# Altium schematic sheet MCU.SchDoc
size A4
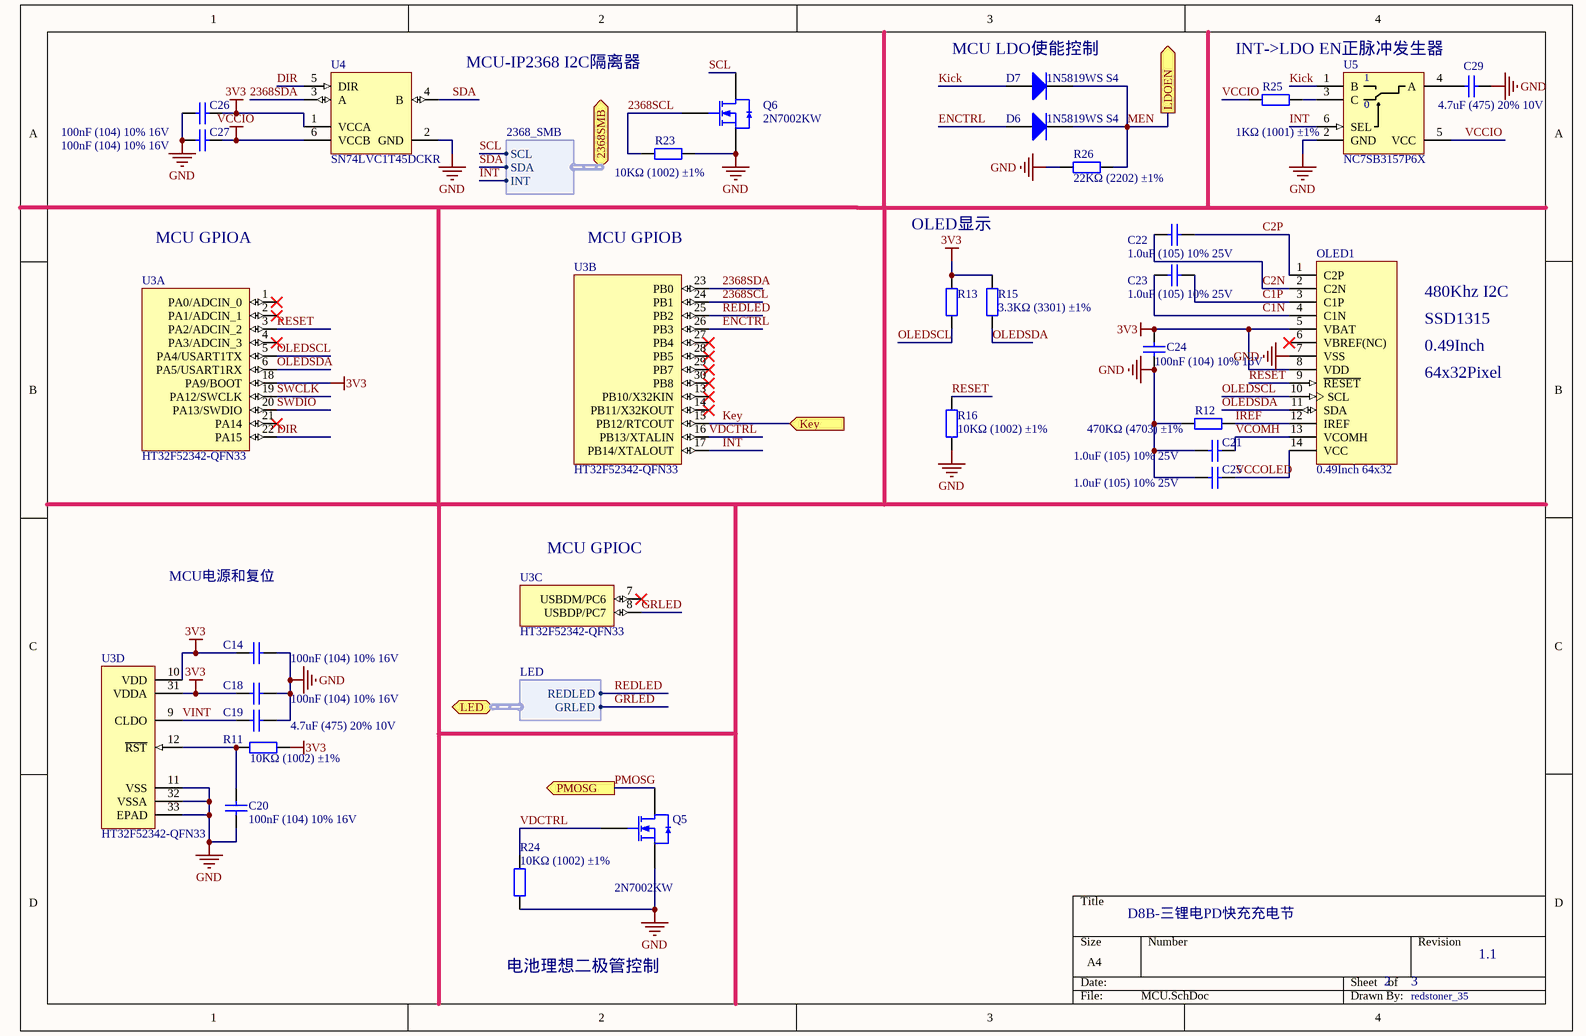
[diagram p0: MCU.SchDoc]

## Parts
C14  100nF (104) 10% 16V  [0402_C]
C18  100nF (104) 10% 16V  [0402_C]
C19  4.7uF (475) 20% 10V  [0402_C]
C20  100nF (104) 10% 16V  [0402_C]
C21  1.0uF (105) 10% 25V  [0402_C]
C22  1.0uF (105) 10% 25V  [0402_C]
C23  1.0uF (105) 10% 25V  [0402_C]
C24  100nF (104) 10% 16V  [0402_C]
C25  1.0uF (105) 10% 25V  [0402_C]
C26  100nF (104) 10% 16V  [0402_C]
C27  100nF (104) 10% 16V  [0402_C]
C29  4.7uF (475) 20% 10V  [0402_C]
D6  1N5819WS S4  [SOD-323]
D7  1N5819WS S4  [SOD-323]
OLED1  0.49Inch 64x32  [OLED-0.49Inch]
Q5  2N7002KW  [SC70-3]
Q6  2N7002KW  [SC70-3]
R11  10KΩ (1002) ±1%  [0402_R]
R12  470KΩ (4703) ±1%  [0402_R]
R13  3.3KΩ (3301) ±1%  [0402_R]  (value not drawn)
R15  3.3KΩ (3301) ±1%  [0402_R]
R16  10KΩ (1002) ±1%  [0402_R]
R23  10KΩ (1002) ±1%  [0402_R]
R24  10KΩ (1002) ±1%  [0402_R]
R25  1KΩ (1001) ±1%  [0402_R]
R26  22KΩ (2202) ±1%  [0402_R]
U3  HT32F52342-QFN33  [QFN32-HT32]  (parts A,B,C,D of 4)
U4  SN74LVC1T45DCKR  [DCK0006A_N]
U5  NC7SB3157P6X  [SC70-6]

## Ports
2368SMB (harness 2368_SMB), Key (in), LDOEN (out), LED (harness LED), PMOSG (out)

## Harnesses
2368_SMB: SCL, SDA, INT
LED: REDLED, GRLED

## Nets
3V3: C14.1 C18.1 C24.2 C26.2 OLED1.5(VBAT) OLED1.8(VDD) R11.2 R13.2 R15.2 U3.10(VDD) U3.18(PA9/BOOT) U3.31(VDDA) U4.1(VCCA)
GND: C14.2 C18.2 C19.2 C20.1 C21.2 C24.1 C25.1 C26.1 C27.1 C29.2 OLED1.7(VSS) Q5.2(S) Q6.2(S) R12.2 R16.1 R23.2 R24.1 R26.1 U3.11(VSS) U3.32(VSSA) U3.33(EPAD) U4.2(GND) U5.2(GND)
VCCIO: C27.2 R25.1 U4.6(VCCB) U5.5(VCC)
2368SCL: Q6.1(G) R23.1 U3.24(PB1)
2368SDA: U3.23(PB0) U4.3(A)
C1N: C23.2 OLED1.4(C1N)
C1P: C23.1 OLED1.3(C1P)
C2N: C22.2 OLED1.2(C2N)
C2P: C22.1 OLED1.1(C2P)
DIR: U3.22(PA15) U4.5(DIR)
ENCTRL: D6.1(A) U3.26(PB3)
GRLED: U3.8(USBDP/PC7) ; port LED.GRLED
INT: U3.17(PB14/XTALOUT) U5.6(SEL) ; port 2368SMB.INT
IREF: OLED1.12(IREF) R12.1
Key: U3.15(PB12/RTCOUT) ; port Key
Kick: D7.1(A) U5.1(B)
MEN: D6.2(K) D7.2(K) R26.2 ; port LDOEN
OLEDSCL: OLED1.10(SCL) R13.1 U3.5(PA4/USART1TX)
OLEDSDA: OLED1.11(SDA) R15.1 U3.6(PA5/USART1RX)
PMOSG: Q5.3(D) ; port PMOSG
REDLED: U3.25(PB2) ; port LED.REDLED
RESET: OLED1.9(~{RESET}) R16.2 U3.3(PA2/ADCIN_2)
SCL: Q6.3(D) ; port 2368SMB.SCL
SDA: U4.4(B) ; port 2368SMB.SDA
SWCLK: U3.19(PA12/SWCLK)
SWDIO: U3.20(PA13/SWDIO)
VCCOLED: C25.2 OLED1.14(VCC)
VCOMH: C21.1 OLED1.13(VCOMH)
VDCTRL: Q5.1(G) R24.2 U3.16(PB13/XTALIN)
VINT: C19.1 U3.9(CLDO)
NetC20_2: C20.2 R11.1 U3.12(~{RST})
NetC29_1: C29.1 U5.4(A)
NetR25_2: R25.2 U5.3(C)

Not connected (* = marked no-connect by the designer): OLED1 6(VBREF(NC))*; U3 1(PA0/ADCIN_0)* 2(PA1/ADCIN_1)* 4(PA3/ADCIN_3)* 7(USBDM/PC6)* 13(PB10/X32KIN)* 14(PB11/X32KOUT)* 21(PA14)* 27(PB4)* 28(PB5)* 29(PB7)* 30(PB8)*

## Notes on the sheet
- MCU-IP2368 I2C隔离器
- (near D7) MCU LDO使能控制
- INT->LDO EN正脉冲发生器
- MCU GPIOA
- (near U3) MCU GPIOB
- OLED显示
- 480Khz I2C
- SSD1315
- 0.49Inch
- 64x32Pixel
- MCU电源和复位
- (near U3) MCU GPIOC
- D8B-三锂电PD快充充电节
- 电池理想二极管控制
- 2
- 3
- 1.1
- redstoner_35
- (in symbol NC7SB3157P6X) 0

## Library data of the parts
C14 C18 C20 C24 C26 C27 = 0402 100nF (104) 10% 16V: 贴片电容; ComponentLink1Description: 供应商链接; ComponentLink1URL: http://www.szlcsc.com/product/details_1877.html; Package: 0402; Supplier: LC; SuppliersPartNumber: C1525
C19 C29 = 0402 4.7uF (475) 20% 10V: 贴片电容; ComponentLink1Description: 供应商链接; ComponentLink1URL: http://www.szlcsc.com/product/details_24469.html; Package: 0402; Supplier: LC; SuppliersPartNumber: C23733
C21-C23 C25 = 0402 1.0uF (105) 10% 25V: 贴片电容; ComponentLink1Description: 供应商链接; ComponentLink1URL: http://www.szlcsc.com/product/details_53938.html; Package: 0402; Supplier: LC; SuppliersPartNumber: C52923
D6 D7 = SOD-323 1N4148WS T4: 二极管; ComponentLink1Description: 供应商链接; ComponentLink1URL: http://www.szlcsc.com/product/details_2485.html; Package: SOD-323; Supplier: LC; SuppliersPartNumber: C??????
OLED1 = 0.49Inch OLED: 0.49英寸OLED 64*32像素
Q5 Q6 = 2N7002 7002: MOS(场效应管); ComponentLink1Description: 供应商链接; ComponentLink1URL: http://www.szlcsc.com/product/details_9040.html; Package: SOT-323; Supplier: LC; SuppliersPartNumber: C???????
R11 R16 R23 R24 = 0402 10KΩ (1002) 1%: 贴片电阻; ComponentLink1Description: 供应商链接; ComponentLink1URL: http://www.szlcsc.com/product/details_26487.html; Package: 0402; Supplier: LC; SuppliersPartNumber: C25744
R12 = 0402 470KΩ (4703) 1%: 贴片电阻; ComponentLink1Description: 供应商链接; ComponentLink1URL: http://www.szlcsc.com/product/details_26533.html; Package: 0402; Supplier: LC; SuppliersPartNumber: C25790
R13 R15 = 0402 3.3KΩ (3301) 1%: 贴片电阻; ComponentLink1Description: 供应商链接; ComponentLink1URL: http://www.szlcsc.com/product/details_26633.html; Package: 0402; Supplier: LC; SuppliersPartNumber: C25890
R25 = 0402 1KΩ (1001) 1%: 贴片电阻; ComponentLink1Description: 供应商链接; ComponentLink1URL: http://www.szlcsc.com/product/details_12256.html; Package: 0402; Supplier: LC; SuppliersPartNumber: C11702
R26 = 0402 22KΩ (2202) 1%: 贴片电阻; ComponentLink1Description: 供应商链接; ComponentLink1URL: http://www.szlcsc.com/product/details_26511.html; Package: 0402; Supplier: LC; SuppliersPartNumber: C25768
U3 = HT32F52352-QFN: Holtek MCU Cortex M0+ 48MHz 64K ROM 16K RAM
U4 = SN74LVC1T45DCKR: Single-Bit Dual-Supply Bus Transceiver with Configurable Voltage Translation and 3-State Outputs, DCK0006A, LARGE T&R; Manufacturer: Texas Instruments; VCC(Min)(V): 1.65; VCC(Max)(V): 5.5; Output Type: CMOS; ICC @ Nom Voltage(Max)(mA): 0.004; Input Type: CMOS/TTL; Bits(#): 1; F @ Nom Voltage(Max)(Mhz): 150; Rating: Catalog; Technology Family: LVC; Voltage(Nom)(V): 1.8,2.5,3.3,5; Schmitt Trigger: No; Output Drive (IOL/IOH)(Max)(mA): 32/-32; tpd @ Nom Voltage(Max)(ns): 15.5,8,5.8,4.4; Logic: True; Sub-Family: Dual Supply Translator; 3-State Output: Yes; DatasheetVersion: SCES515K; PackageReference: DCK0006A; Supplier 1: Mouser; Supplier Part Number 1: 595-SN74LVC1T45DCKR; Supplier 2: Digi-Key; Supplier Part Number 2: 296-16844-2-ND; Supplier 3: Digi-Key; Supplier Part Number 3: 296-16844-1-ND; Supplier 4: Digi-Key; Supplier Part Number 4: 296-16844-6-ND; Generic Part Number: SN74LVC1T45; Operating Temperature Range(C): -40 to 85; PartNumber: SN74LVC1T45DCKR; ComponentLink1Description: Manufacturer URL; ComponentLink1URL: http://www.ti.com/; ComponentLink2Description: Datasheet; ComponentLink2URL: http://www.ti.com/lit/ds/symlink/sn74lvc1t45.pdf
U5 = NC7SB3157P6X: Low-Voltage Analog Switch SPDT,1.8-5V Power